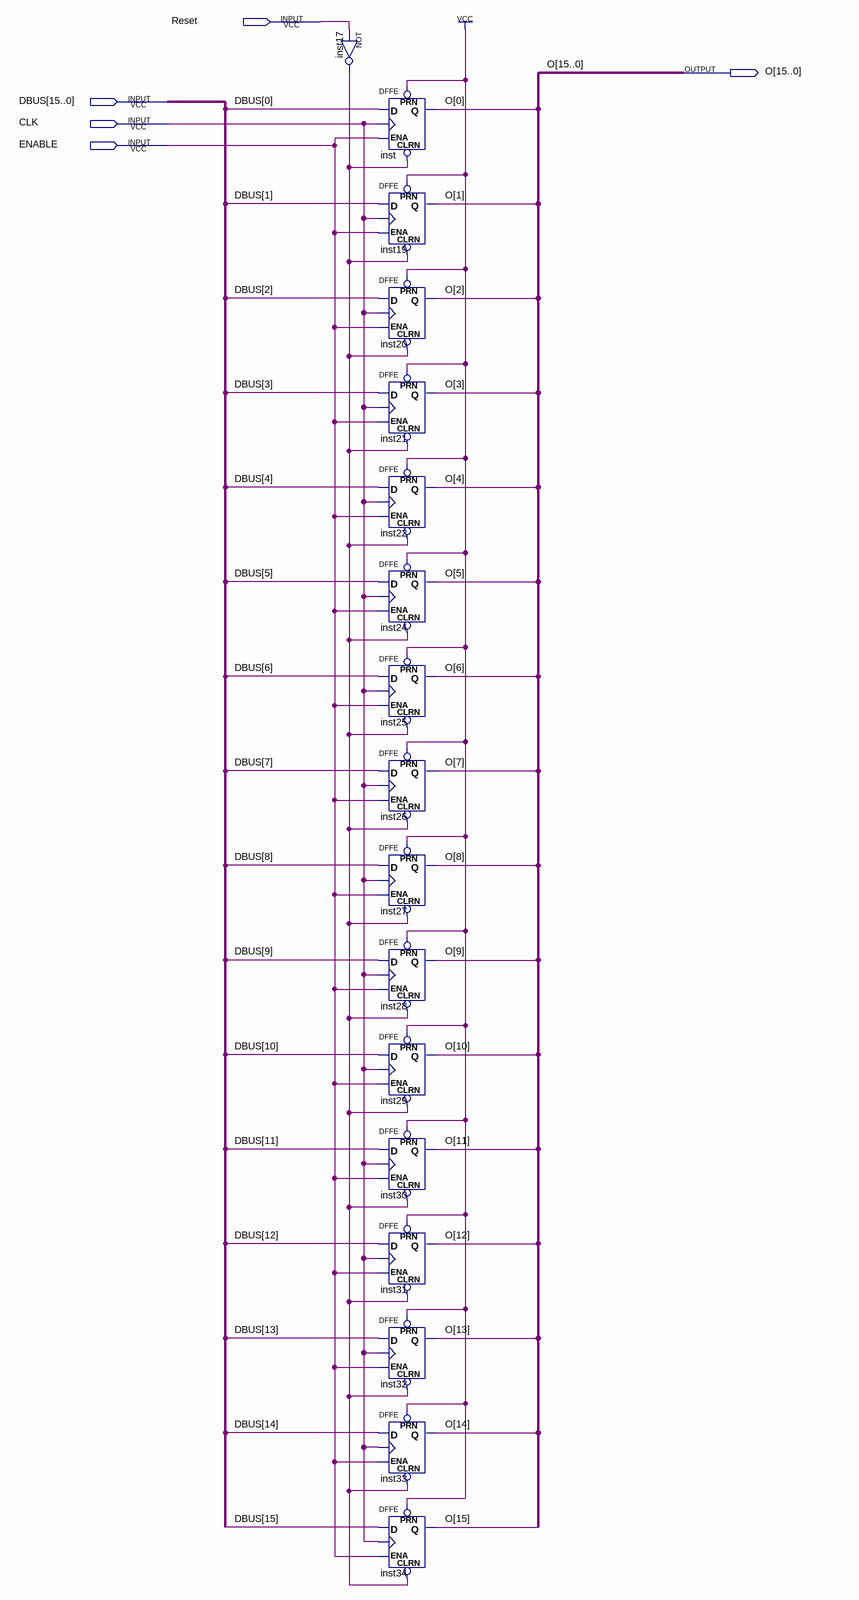
[diagram p0: schematic sheet]
// Quartus schematic 16BitRegister.bdf as structural Verilog: 17 symbols, 5 pins
module \16BitRegister  (
  input  Reset,
  input  [15:0] DBUS,
  input  CLK,
  input  ENABLE,
  output [15:0] O
);

  wire inst17_out;

  not inst17 (inst17_out, Reset);
  DFFE inst (.PRN(1'b1), .CLRN(inst17_out), .D(DBUS[0]), .CLK(CLK), .ENA(ENABLE), .Q(O[0]));
  DFFE inst19 (.PRN(1'b1), .CLRN(inst17_out), .D(DBUS[1]), .CLK(CLK), .ENA(ENABLE), .Q(O[1]));
  DFFE inst20 (.PRN(1'b1), .CLRN(inst17_out), .D(DBUS[2]), .CLK(CLK), .ENA(ENABLE), .Q(O[2]));
  DFFE inst21 (.PRN(1'b1), .CLRN(inst17_out), .D(DBUS[3]), .CLK(CLK), .ENA(ENABLE), .Q(O[3]));
  DFFE inst22 (.PRN(1'b1), .CLRN(inst17_out), .D(DBUS[4]), .CLK(CLK), .ENA(ENABLE), .Q(O[4]));
  DFFE inst24 (.PRN(1'b1), .CLRN(inst17_out), .D(DBUS[5]), .CLK(CLK), .ENA(ENABLE), .Q(O[5]));
  DFFE inst25 (.PRN(1'b1), .CLRN(inst17_out), .D(DBUS[6]), .CLK(CLK), .ENA(ENABLE), .Q(O[6]));
  DFFE inst26 (.PRN(1'b1), .CLRN(inst17_out), .D(DBUS[7]), .CLK(CLK), .ENA(ENABLE), .Q(O[7]));
  DFFE inst27 (.PRN(1'b1), .CLRN(inst17_out), .D(DBUS[8]), .CLK(CLK), .ENA(ENABLE), .Q(O[8]));
  DFFE inst28 (.PRN(1'b1), .CLRN(inst17_out), .D(DBUS[9]), .CLK(CLK), .ENA(ENABLE), .Q(O[9]));
  DFFE inst29 (.PRN(1'b1), .CLRN(inst17_out), .D(DBUS[10]), .CLK(CLK), .ENA(ENABLE), .Q(O[10]));
  DFFE inst30 (.PRN(1'b1), .CLRN(inst17_out), .D(DBUS[11]), .CLK(CLK), .ENA(ENABLE), .Q(O[11]));
  DFFE inst31 (.PRN(1'b1), .CLRN(inst17_out), .D(DBUS[12]), .CLK(CLK), .ENA(ENABLE), .Q(O[12]));
  DFFE inst32 (.PRN(1'b1), .CLRN(inst17_out), .D(DBUS[13]), .CLK(CLK), .ENA(ENABLE), .Q(O[13]));
  DFFE inst33 (.PRN(1'b1), .CLRN(inst17_out), .D(DBUS[14]), .CLK(CLK), .ENA(ENABLE), .Q(O[14]));
  DFFE inst34 (.PRN(1'b1), .CLRN(inst17_out), .D(DBUS[15]), .CLK(CLK), .ENA(ENABLE), .Q(O[15]));
endmodule
